# EAGLE schematic RGBMatrixHat (EAGLE 7.6.0)
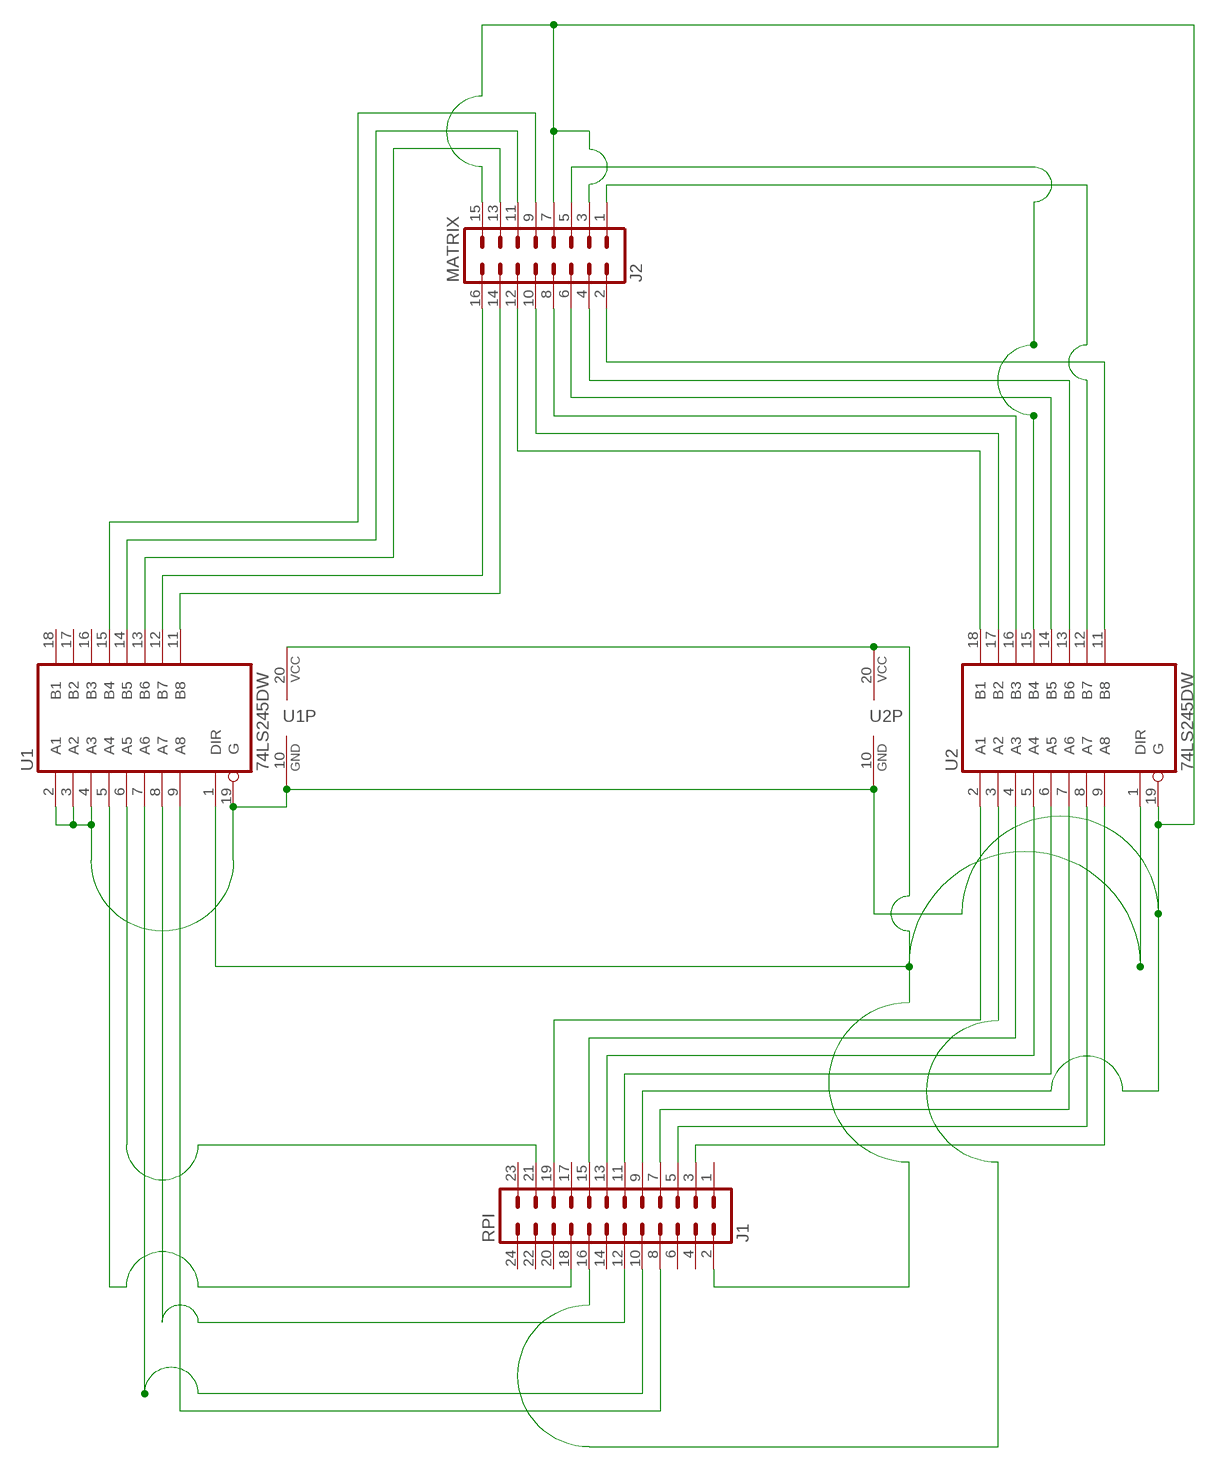
[diagram p0: schematic, sheet 1]

## Parts
MATRIX  J2  MA08-2  [MA08-2]
RPI  J1  MA12-2  [MA12-2]
U1  74LS245DW  [SO20W]
U2  74LS245DW  [SO20W]

## Nets
GND: MATRIX.3 MATRIX.7 MATRIX.15 RPI.9 U1.2(A1) U1.3(A2) U1.4(A3) U1.10(GND) U1.19(G) U2.10(GND) U2.19(G)
N$1: RPI.3 U2.9(A8)
N$2: RPI.5 U2.8(A7)
N$3: RPI.7 U2.7(A6)
N$4: MATRIX.2 U2.11(B8)
N$5: MATRIX.4 U2.13(B6)
N$6: MATRIX.5 U2.15(B4)
N$7: MATRIX.1 U2.12(B7)
N$8: RPI.11 U2.6(A5)
N$9: RPI.13 U2.5(A4)
N$10: RPI.15 U2.4(A3)
N$11: MATRIX.6 U2.14(B5)
N$12: MATRIX.8 U2.16(B3)
N$13: MATRIX.14 U1.11(B8)
N$15: RPI.8 U1.9(A8)
N$16: MATRIX.10 U2.17(B2)
N$17: MATRIX.12 U2.18(B1)
N$18: MATRIX.16 U1.12(B7)
N$19: RPI.19 U2.2(A1)
N$20: RPI.16 U2.3(A2)
N$21: MATRIX.9 U1.15(B4)
N$22: MATRIX.11 U1.14(B5)
N$23: RPI.12 U1.8(A7)
N$24: MATRIX.13 U1.13(B6)
N$27: RPI.10 U1.7(A6)
N$28: RPI.2 U1.1(DIR) U1.20(VCC) U2.1(DIR) U2.20(VCC)
N$30: RPI.21 U1.6(A5)
N$31: RPI.18 U1.5(A4)
Unconnected: RPI.1 RPI.4 RPI.6 RPI.14 RPI.17 RPI.20 RPI.22 RPI.23 RPI.24 U1.16(B3) U1.17(B2) U1.18(B1)

## Library data of the parts
MATRIX = con-lstb:MA08-2: PIN HEADER; OC_FARNELL: unknown; OC_NEWARK: unknown
RPI = con-lstb:MA12-2: PIN HEADER; OC_FARNELL: unknown; OC_NEWARK: unknown
U1 U2 = 74xx-us:74*245: Octal BUS TRANSCEIVER, 3-state